# Altium project STM32G0.PrjPcb
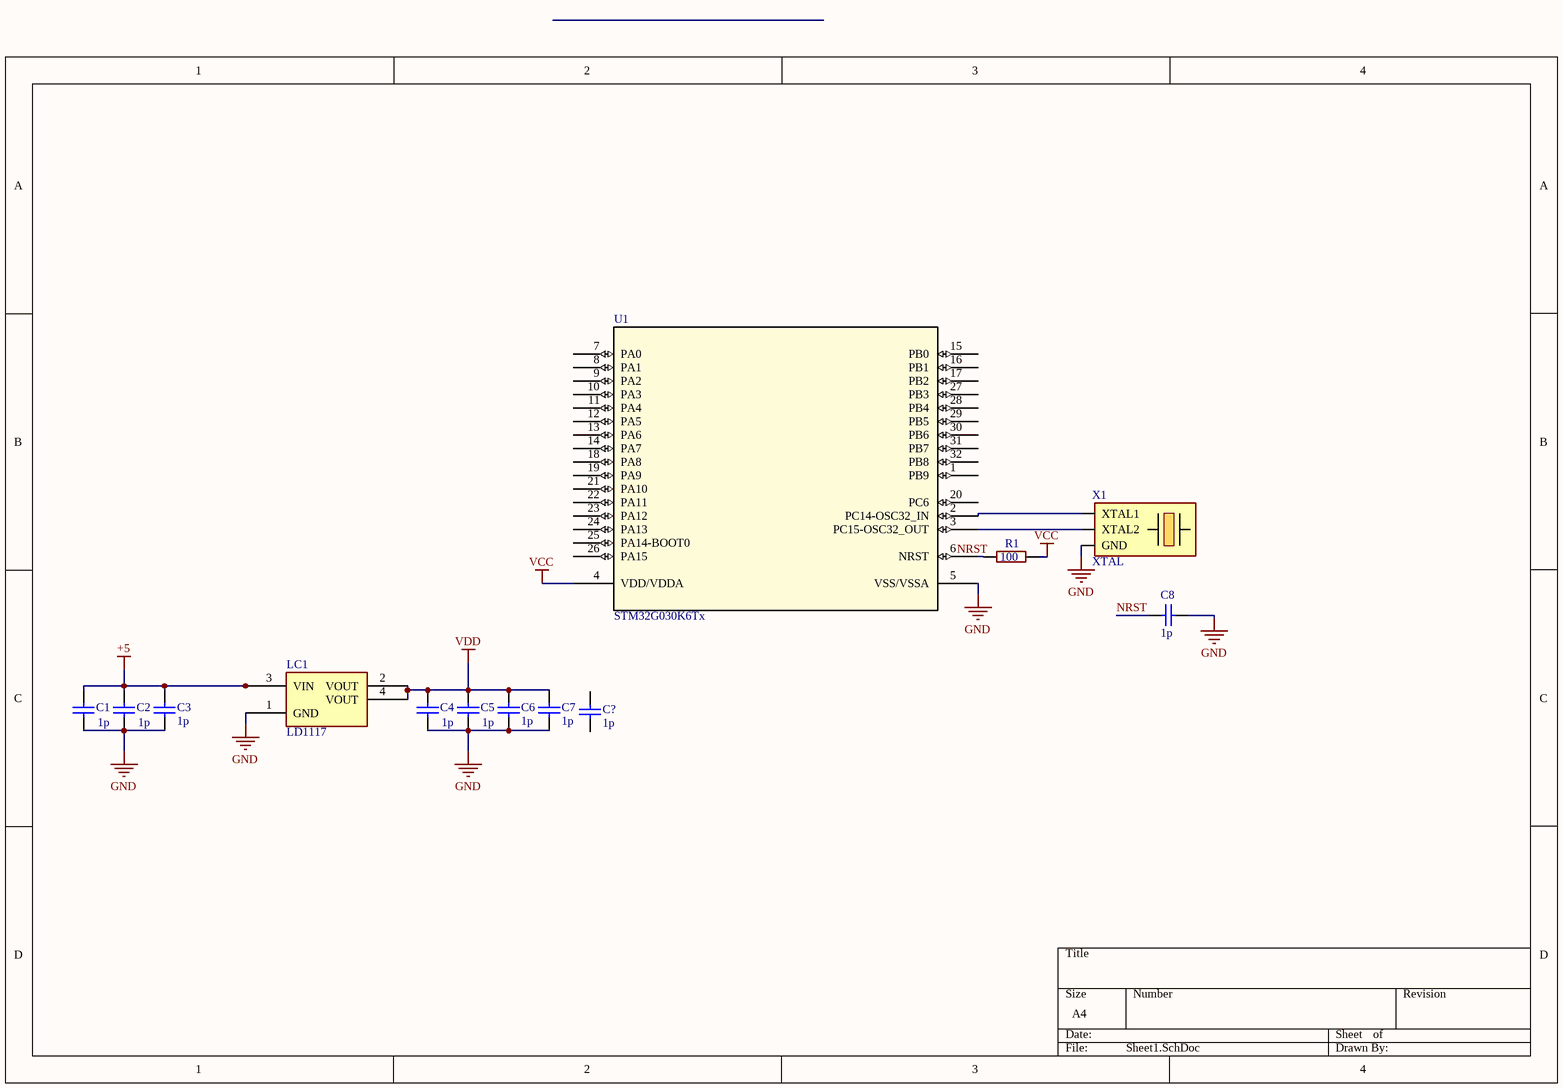
[diagram p0: Sheet1.SchDoc]
1 sheet, 13 parts. Net scope: global (net labels, ports and power ports of the same name join across sheets).
Board file: PCB1.PcbDoc

## Sheet Sheet1.SchDoc
size A4; SheetNumber: 1; SheetTotal: 1

### Parts
C1  value 1p  (hidden comment: Capacitor)
C2  value 1p  (hidden comment: Capacitor)
C3  value 1p  (hidden comment: Capacitor)
C4  value 1p  (hidden comment: Capacitor)
C5  value 1p  (hidden comment: Capacitor)
C6  value 1p  (hidden comment: Capacitor)
C7  value 1p  (hidden comment: Capacitor)
C8  value 1p  (hidden comment: Capacitor)
C?  value 1p  (hidden comment: Capacitor)
LC1  LD1117  [LD1117_SOT-223]
R1  100  [Resistor_smd_0805]
U1  STM32G030K6Tx  [LQFP-32]
X1  XTAL

### Nets
+5: C1.2 C2.2 C3.2 LC1.3(VIN)
GND: C1.1 C2.1 C3.1 C4.1 C5.1 C6.1 C7.1 C8.1 LC1.1(GND) U1.5(VSS/VSSA) X1.3(GND)
VCC: R1.2 U1.4(VDD/VDDA)
VDD: C4.2 C5.2 C6.2 C7.2 LC1.2(VOUT) LC1.4(VOUT)
NRST: C8.2
NetR1_1: R1.1 U1.6(NRST)
NetU1_2: U1.2(PC14-OSC32_IN) X1.1(XTAL1)
NetU1_3: U1.3(PC15-OSC32_OUT) X1.2(XTAL2)

Not connected (* = marked no-connect by the designer): C? 1 2; U1 1(PB9) 7(PA0) 8(PA1) 9(PA2) 10(PA3) 11(PA4) 12(PA5) 13(PA6) 14(PA7) 15(PB0) 16(PB1) 17(PB2) 18(PA8) 19(PA9) 20(PC6) 21(PA10) 22(PA11) 23(PA12) 24(PA13) 25(PA14-BOOT0) 26(PA15) 27(PB3) 28(PB4) 29(PB5) 30(PB6) 31(PB7) 32(PB8)

### Notes on the sheet
- Labels drawn without touching a wire or pin: NRST

### Library data of the parts
C1-C8 C? = Capacitor: SimulationGenericComponent: True
R1 = Resistor_smd
U1 = STM32G030K6Tx: The STM32G030x6/x8 mainstream microcontrollers are based on high-performance Arm® Cortex®-M0+ 32-bit RISC core operating at up to 64 MHz frequency. / 32K Flash and 8K RAM with 32pin LQFP 7x7x1.4 package; Manufacturer_Part_Number: STM32G0_LQFP32_T2; Vendor: STMicroelectronics; Copyright: Copyright (C) 2018 Accelerated Designs. All rights reserved; RefDes: RefDes; Type: DEV; Value: Value